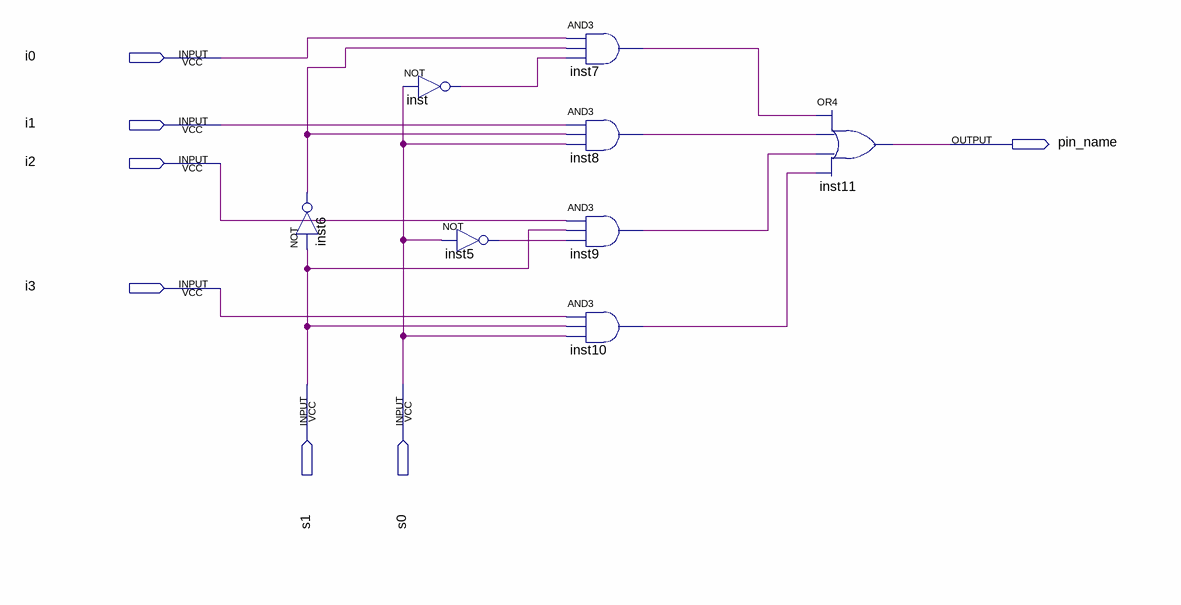
[diagram p0: schematic sheet]
// Quartus schematic lab02_3.bdf as structural Verilog: 8 symbols, 7 pins
module lab02_3 (
  input  i0,
  input  i1,
  input  i2,
  input  i3,
  input  s1,
  input  s0,
  output pin_name
);

  wire inst5_out, inst6_out, inst7_out, inst8_out, inst9_out, inst10_out, inst_out;

  not inst6 (inst6_out, s1);
  not inst (inst_out, s0);
  not inst5 (inst5_out, s0);
  and inst7 (inst7_out, i0, inst6_out, inst_out);
  and inst8 (inst8_out, i1, inst6_out, s0);
  and inst9 (inst9_out, i2, s1, inst5_out);
  and inst10 (inst10_out, i3, s1, s0);
  or inst11 (pin_name, inst7_out, inst8_out, inst9_out, inst10_out);
endmodule
